# Altium schematic sheet Servo5.SchDoc
size A1
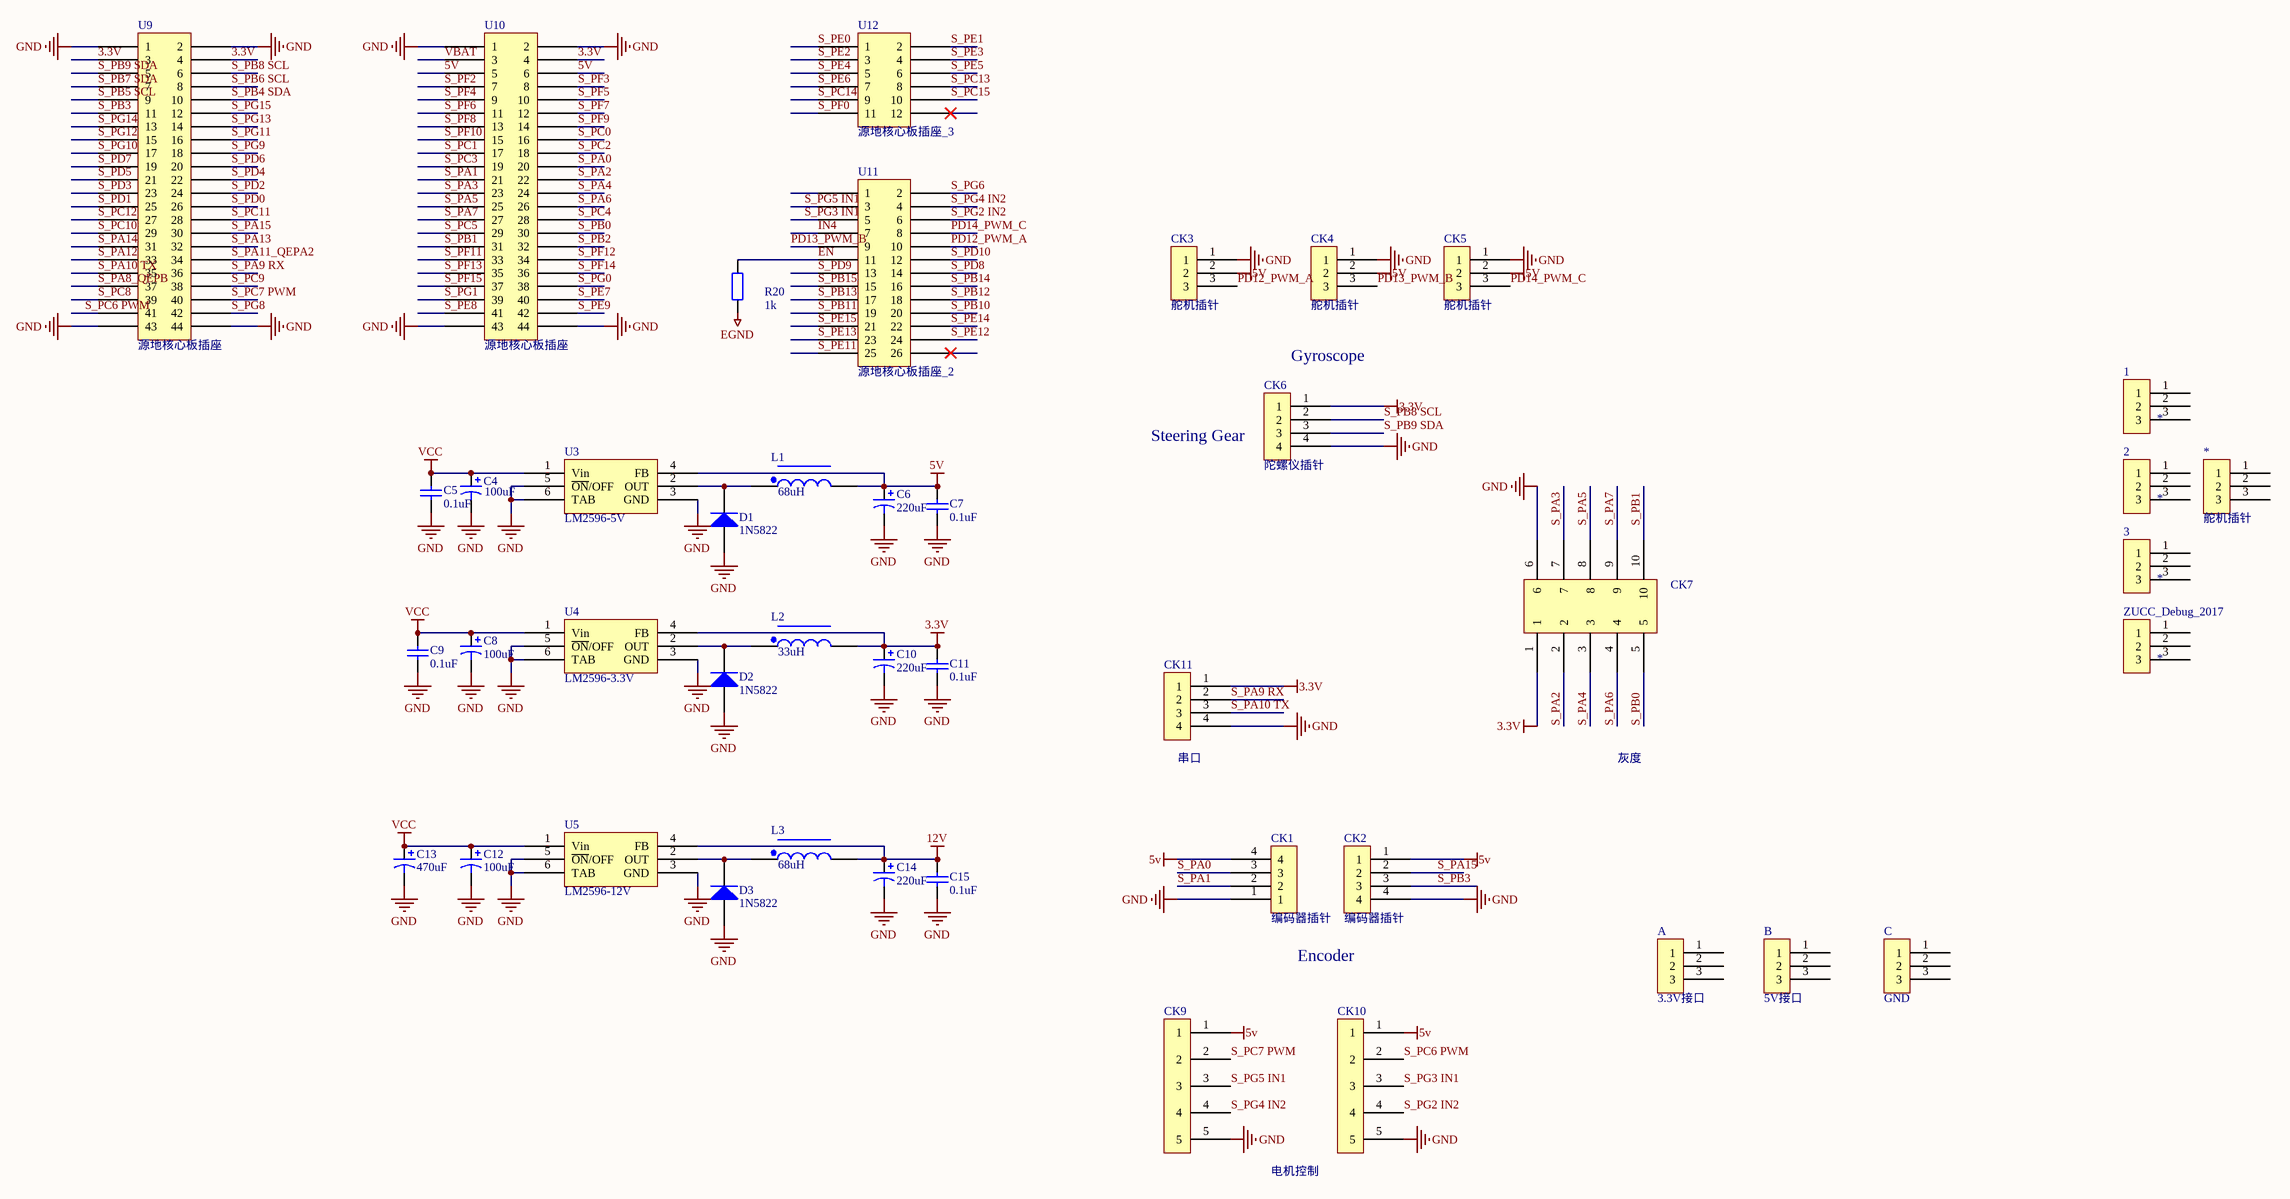
[diagram p0: Servo5.SchDoc]

## Parts
1  *  [3mm洞]
2  *  [3mm洞]
3  *  [3mm洞]
*  舵机插针
A  3.3V接口  [3个接口]
B  5V接口  [3个接口]
C  GND  [3个接口]
C4  value 100uF  [100μF电容]  (hidden comment: C2)
C5  value 0.1uF  [贴片电容]  (hidden comment: C)
C6  value 220uF  [220μF电容]  (hidden comment: C2)
C7  value 0.1uF  [0805贴片电容]  (hidden comment: C)
C8  value 100uF  [100μF（电源接口）]  (hidden comment: C2)
C9  value 0.1uF  [贴片电容]  (hidden comment: C)
C10  value 220uF  [220μF电容]  (hidden comment: C2)
C11  value 0.1uF  [0805贴片电容]  (hidden comment: C)
C12  value 100uF  [100μF（电源接口）]  (hidden comment: C2)
C13  value 470uF  [100μF电容]  (hidden comment: C2)
C14  value 220uF  [220μF电容]  (hidden comment: C2)
C15  value 0.1uF  [0805贴片电容]  (hidden comment: C)
CK1  编码器插针  [单排4]
CK2  编码器插针  [单排4]
CK3  舵机插针  [3个接口]
CK4  舵机插针  [3个接口]
CK5  舵机插针  [3个接口]
CK6  陀螺仪插针  [单排4]
CK7  灰度  [P2之2*5]
CK9  电机控制  [单排接口5]
CK10  (no value)  [单排接口5]
CK11  串口  [单排4]
D1  1N5822  [二极管]
D2  1N5822  [二极管]
D3  1N5822  [二极管]
L1  value 68uH  [电感]  (hidden comment: Inductor Iron Dot)
L2  value 33uH  [电感]  (hidden comment: Inductor Iron Dot)
L3  value 68uH  [电感]  (hidden comment: Inductor Iron Dot)
R20  value 1k  [0805封装]  (hidden comment: R)
U3  LM2596-5V  [5x1稳压芯片]
U4  LM2596-3.3V  [5x1稳压芯片]
U5  LM2596-12V  [5x1稳压芯片]
U9  源地核心板插座  [源地核心板插座]
U10  源地核心板插座  [源地核心板插座]
U11  源地核心板插座_2  [源地核心板插座_2]
U12  源地核心板插座_3  [源地核心板插座_3]
ZUCC_Debug_2017  *  [3mm洞]

## Nets
3.3V: C10.1 C11.1 CK6.1 CK7.1 CK11.1 L2.2 U4.4(FB) U9.3 U9.4 U10.4
5V: C6.1 C7.2 CK1.4 CK2.1 CK3.2 CK4.2 CK5.2 CK9.1 CK10.1 L1.2 U3.4(FB) U10.5 U10.6
12V: C14.1 C15.1 L3.2 U5.4(FB)
EGND: R20.1
GND: C4.2 C5.2 C6.2 C7.1 C8.2 C9.2 C10.2 C11.2 C12.2 C13.2 C14.2 C15.2 CK1.1 CK2.4 CK3.1 CK4.1 CK5.1 CK6.4 CK7.6 CK9.5 CK10.5 CK11.4 D1.1(A) D2.1(A) D3.1(A) U3.3(GND) U3.5(~{ON}/OFF) U3.6(TAB) U4.3(GND) U4.5(~{ON}/OFF) U4.6(TAB) U5.3(GND) U5.5(~{ON}/OFF) U5.6(TAB) U9.1 U9.2 U9.43 U9.44 U10.1 U10.2 U10.43 U10.44
VCC: C4.1 C5.1 C8.1 C9.1 C12.1 C13.1 U3.1(Vin) U4.1(Vin) U5.1(Vin)
EN: R20.2 U11.11
IN4: U11.7
PD12_PWM_A: CK3.3 U11.10
PD13_PWM_B: CK4.3 U11.9
PD14_PWM_C: CK5.3 U11.8
S_PA0: CK1.3 U10.20
S_PA1: CK1.2 U10.21
S_PA2: CK7.2 U10.22
S_PA3: CK7.7 U10.23
S_PA4: CK7.3 U10.24
S_PA5: CK7.8 U10.25
S_PA6: CK7.4 U10.26
S_PA7: CK7.9 U10.27
S_PA8_QEPB: U9.37
S_PA9 RX: CK11.2 U9.36
S_PA10 TX: CK11.3 U9.35
S_PA11_QEPA2: U9.34
S_PA12: U9.33
S_PA13: U9.32
S_PA14: U9.31
S_PA15: CK2.2 U9.30
S_PB0: CK7.5 U10.30
S_PB1: CK7.10 U10.31
S_PB2: U10.32
S_PB3: CK2.3 U9.11
S_PB4 SDA: U9.10
S_PB5 SCL: U9.9
S_PB6 SCL: U9.8
S_PB7 SDA: U9.7
S_PB8 SCL: CK6.2 U9.6
S_PB9 SDA: CK6.3 U9.5
S_PB10: U11.20
S_PB11: U11.19
S_PB12: U11.18
S_PB13: U11.17
S_PB14: U11.16
S_PB15: U11.15
S_PC0: U10.16
S_PC1: U10.17
S_PC2: U10.18
S_PC3: U10.19
S_PC4: U10.28
S_PC5: U10.29
S_PC6 PWM: CK10.2 U9.41
S_PC7 PWM: CK9.2 U9.40
S_PC8: U9.39
S_PC9: U9.38
S_PC10: U9.29
S_PC11: U9.28
S_PC12: U9.27
S_PC13: U12.8
S_PC14: U12.9
S_PC15: U12.10
S_PD0: U9.26
S_PD1: U9.25
S_PD2: U9.24
S_PD3: U9.23
S_PD4: U9.22
S_PD5: U9.21
S_PD6: U9.20
S_PD7: U9.19
S_PD8: U11.14
S_PD9: U11.13
S_PD10: U11.12
S_PE0: U12.1
S_PE1: U12.2
S_PE2: U12.3
S_PE3: U12.4
S_PE4: U12.5
S_PE5: U12.6
S_PE6: U12.7
S_PE7: U10.40
S_PE8: U10.41
S_PE9: U10.42
S_PE11: U11.25
S_PE12: U11.24
S_PE13: U11.23
S_PE14: U11.22
S_PE15: U11.21
S_PF0: U12.11
S_PF2: U10.7
S_PF3: U10.8
S_PF4: U10.9
S_PF5: U10.10
S_PF6: U10.11
S_PF7: U10.12
S_PF8: U10.13
S_PF9: U10.14
S_PF10: U10.15
S_PF11: U10.33
S_PF12: U10.34
S_PF13: U10.35
S_PF14: U10.36
S_PF15: U10.37
S_PG0: U10.38
S_PG1: U10.39
S_PG2 IN2: CK10.4 U11.6
S_PG3 IN1: CK10.3 U11.5
S_PG4 IN2: CK9.4 U11.4
S_PG5 IN1: CK9.3 U11.3
S_PG6: U11.2
S_PG8: U9.42
S_PG9: U9.18
S_PG10: U9.17
S_PG11: U9.16
S_PG12: U9.15
S_PG13: U9.14
S_PG14: U9.13
S_PG15: U9.12
VBAT: U10.3
NetD1_2: D1.2(K) L1.1 U3.2(OUT)
NetD2_2: D2.2(K) L2.1 U4.2(OUT)
NetD3_2: D3.2(K) L3.1 U5.2(OUT)

Not connected (* = marked no-connect by the designer): 1 1 2 3; 2 1 2 3; 3 1 2 3; * 1 2 3; A 1 2 3; B 1 2 3; C 1 2 3; U11 1 26*; U12 12*; ZUCC_Debug_2017 1 2 3

## Notes on the sheet
- Gyroscope
- (near CK6) Steering Gear
- Encoder

## Library data of the parts
1-3 * A B C CK3-CK5 ZUCC_Debug_2017 = Component_1
CK1 CK2 CK6 CK11 = 4插针
CK9 CK10 = Component_3
D1-D3 = Diode 1N5400: 3 Amp General Purpose Rectifier; Published: 8-Jun-2000; LatestRevisionDate: 17-Jul-2002; LatestRevisionNote: Re-released for DXP Platform.; DatasheetVersion: 1998; PackageVersion: Aug-1999; PackageReference: DO-201AD; Publisher: Altium Limited; PackageDescription: Diode, Axial; Body 9.5 x 5.6 mm (LxDia. max), Lead Dia. 1.32 mm (max); ComponentLink1Description: Manufacturer Link; ComponentLink1URL: http://www.fairchildsemi.com/; ComponentLink2Description: Datasheet; ComponentLink2URL: http://www.fairchildsemi.com/ds/1N%2F1N5400.pdf
L1-L3 = Inductor Iron Dot: Magnetic-Core Inductor with Winding Polarity Marking; Published: 24-Mar-1999; LatestRevisionDate: 17-Jul-2002; LatestRevisionNote: Re-released for DXP Platform.; PackageReference: DIODE_SMC; Publisher: Altium Limited; PackageDescription: Diode; 2 Leads
U3-U5 = LM2596